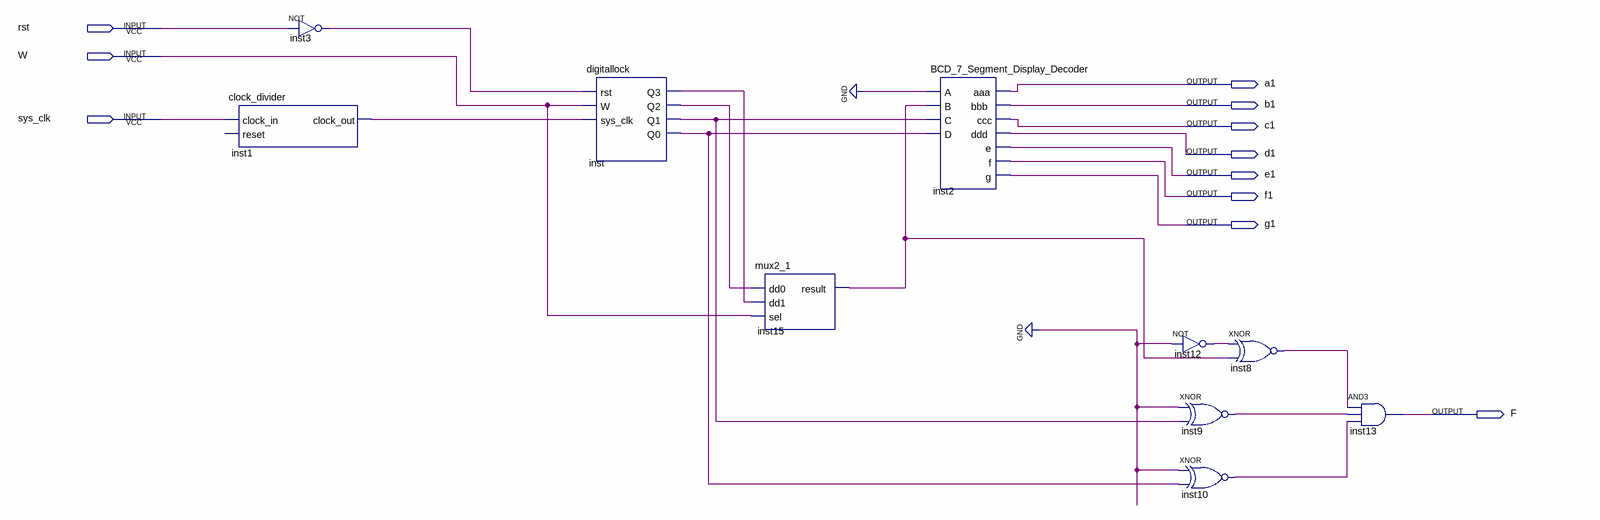
[diagram p0: schematic sheet]
// Quartus schematic full_digitalLock.bdf as structural Verilog: 10 symbols, 11 pins
module full_digitalLock (
  input  rst,
  input  W,
  input  sys_clk,
  output a1,
  output b1,
  output c1,
  output d1,
  output e1,
  output f1,
  output g1,
  output F
);

  wire inst1_clock_out, inst3_out, inst8_out, inst9_out, inst10_out, inst12_out, inst15_result, inst_q0,
       inst_q1, inst_q2, inst_q3;

  clock_divider inst1 (.clock_in(sys_clk), .clock_out(inst1_clock_out));  // open: reset
  not inst3 (inst3_out, rst);
  digitallock inst (
    .rst(inst3_out), .W(W), .sys_clk(inst1_clock_out), .Q3(inst_q3), .Q2(inst_q2), .Q1(inst_q1), .Q0(inst_q0));
  mux2_1 inst15 (.dd0(inst_q2), .dd1(inst_q3), .sel(W), .result(inst15_result));
  BCD_7_Segment_Display_Decoder inst2 (
    .A(1'b0), .B(inst15_result), .C(inst_q1), .D(inst_q0), .aaa(a1), .bbb(b1), .ccc(c1), .ddd(d1), .e(e1),
    .f(f1), .g(g1));
  not inst12 (inst12_out, 1'b0);
  xnor inst9 (inst9_out, 1'b0, inst_q1);
  xnor inst10 (inst10_out, 1'b0, inst_q0);
  xnor inst8 (inst8_out, inst12_out, inst15_result);
  and inst13 (F, inst8_out, inst9_out, inst10_out);
endmodule
